# Altium schematic sheet TempSensor.SchDoc
size A; SheetNumber: 4; SheetTotal: 7
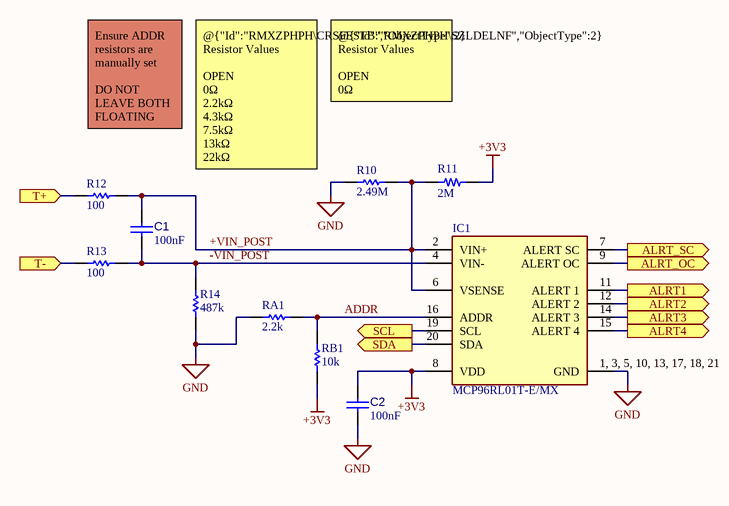
[diagram p0: TempSensor.SchDoc]

## Parts
C1  value 100nF  [CAP 0805_2012]  (hidden comment: CL21B104KBCNNNC)
C2  value 100nF  [CAP 0805_2012]  (hidden comment: CL21B104KBCNNNC)
IC1  MCP96RL01T-E/MX  [QFN65P500X500X100-21N-D]
R10  value 2.49M  [RES 0805_2012]  (hidden comment: CRCW08052M49FKEA)
R11  value 2M  [RES 0805_2012]  (hidden comment: CRCW08052M00FKECC)
R12  value 100  [RES 0805_2012]  (hidden comment: CRG0805F100R)
R13  value 100  [RES 0805_2012]  (hidden comment: CRG0805F100R)
R14  value 487k  [RES 0805_2012]  (hidden comment: ERJ-6ENF4873V)
RA1  value 2.2k  [RES 0805_2012]  (hidden comment: CRCW08052K20FKEAC)
RB1  value 10k  [RES 0805_2012]  (hidden comment: CRCW080510K0FKEAC)

## Ports
ALRT1 (out), ALRT2 (out), ALRT3 (out), ALRT4 (out), ALRT_OC (out), ALRT_SC (out), SCL (out), SDA (out), T+ (in), T- (in)

## Nets
+3V3: C2.1 IC1.8(VDD) R11.2 RB1.1
GND: C2.2 IC1.1,_3,_5,_10,_13,_17,_18,_21(GND) R10.1 R14.1 RA1.1
+VIN_POST: C1.2 IC1.2(VIN+) IC1.6(VSENSE) R10.2 R11.1 R12.2
-VIN_POST: C1.1 IC1.4(VIN-) R13.2 R14.2
ADDR: IC1.16(ADDR) RA1.2 RB1.2
ALRT1: IC1.11(ALERT_1) ; port ALRT1
ALRT2: IC1.12(ALERT_2) ; port ALRT2
ALRT3: IC1.14(ALERT_3) ; port ALRT3
ALRT4: IC1.15(ALERT_4) ; port ALRT4
ALRT_OC: IC1.9(ALERT_OC) ; port ALRT_OC
ALRT_SC: IC1.7(ALERT_SC) ; port ALRT_SC
SCL: IC1.19(SCL) ; port SCL
SDA: IC1.20(SDA) ; port SDA
T+: R12.1 ; port T+
T-: R13.1 ; port T-

## Notes on the sheet
- Ensure ADDR resistors are manually set
  DO NOT LEAVE BOTH FLOATING
- @{"Id":"RMXZPHPH\SZLDELNF","ObjectType":2} Resistor Values
  OPEN
  0Ω
  10kΩ
- (near R10) @{"Id":"RMXZPHPH\CRSFESTB","ObjectType":2} Resistor Values
  OPEN
  0Ω
  2.2kΩ
  4.3kΩ
  7.5kΩ
  13kΩ
  22kΩ
  43kΩ

## Library data of the parts
C1 C2 = CMP-001-00134-5: Ceramic Capacitor, Multilayer, Ceramic, 50V, 10% +Tol, 10% -Tol, X7R, 15% TC, 0.1uF, Surface Mount, 0805; Multilayer: Yes; Mounting Technology: Surface Mount; RoHS Compliant: Yes; Pins: 2; Capacitor Type: Ceramic; Min Operating Temperature: -55°C; Max Operating Temperature: 125°C; Case/Package: 0805; Dielectric Material: Ceramic; Height: 0.95mm; JESD-609 Code: e3; Length: 2mm; Package Shape: Rectangular; Package Style: SMTMeter; Packaging: Tape and Reel; Rated DC Voltage (URdc): 50V; Reach SVHC Compliant: Yes; Temperature Characteristics Code: X7R; Terminal Finish: Nickel; Termination: Wraparound; Tolerance  (fill in as +-): 10%; Tolerance (fill in as +-): 10%; Width: 1.25mm
IC1 = CMP-031-00000-3: Fully integrated thermocouple Electromotive Force (EMF) to degrees Celsius converter IC with integrated thermocouple open-circuit and short-circuit detection and cold-junction compensation; Manufacturer_Name: Microchip; altium.hash: 88D551B438FC0B2CC4B3D3B3F597121D; Manufacturer_Part_Number: MCP96RL01T-E/MX; Mouser Price/Stock: https://www.mouser.com/Search/Refine.aspx?Keyword=579-MCP96RL01T-E%2FMX; Design Item ID: MCP96RL01T-E_MX; Source: SamacSys.SchLib; Datasheet Link: http://ww1.microchip.com/downloads/en/DeviceDoc/MCP960X-L0X-RL0X-Data-Sheet-20005426F.pdf; Mouser Part Number: 579-MCP96RL01T-E/MX; Height: 1mm
R10 = CMP-009-00019-1: Fixed Resistor, Metal Glaze/thick Film, 0.125W, 2490000ohm, 150V, 1% +/-Tol, 100ppm/Cel, Surface Mount, 0805; Package Height: 0.45mm; Power: 125mW; Reference Standard: AEC-Q200; Package Length: 2mm; Package Width: 1.25mm; Rated Temperature: 70°C; Temperature Coefficient: 100ppm/°C; Termination: Wraparound; Working Voltage: 150V; Pins: 2; Min Operating Temperature: -55°C; RoHS Compliant: Yes; Terminal Finish: Nickel; Package Style: SMTMeter; Resistor Type: FIXED RESISTOR; Technology: METAL GLAZE/THICK FILM; Package Shape: Rectangular; Max Operating Temperature: 155°C; Reach SVHC Compliant: Yes; Case/Package: 0805; Tolerance: 1%; Packaging: Tape and Reel; Mounting Technology: Surface Mount; JESD-609 Code: e3; Construction: Chip
R11 = CMP-009-00017-3: Fixed Resistor, Metal Glaze/thick Film, 0.125W, 2000000ohm, 150V, 1% +/-Tol, 100ppm/Cel, Surface Mount, 0805; Manufacturer: Vishay Dale; Package Height: 0.5mm; Power (Watts): 0.125W, 1/8W; Package Length: 2mm; Power: 125mW; Package Width: 1.25mm; Temperature Coefficient: -100100ppm/°C; ComponentLink1Description: Datasheet; Series: CRCW-C; Package / Case: 0805 (2012 Metric); Case/Package: 0805; Number of Terminations: 2; Size / Dimension: 0.079" L x 0.049" W (2.00mm x 1.25mm); ComponentLink1URL: http://www.vishay.com/docs/28773/crcwce3.pdf; Lifecycle Status: Active; Device Package: 0805 (2012 Metric); Pins: 2; RoHS Compliant: Yes; Supplier Device Package: 0805; ComponentLink2Description: DigiKey Link; Resistor Type: FIXED RESISTOR; LastUpdated: 9/18/2022 12:42:15 PM; Construction: Chip; JESD-609 Code: e3; Technology: METAL GLAZE/THICK FILM; Working Voltage: 150V; Package Style: SMTMeter; Part Number: CRCW08052M00FKECC; Height - Seated (Max): 0.024" (0.60mm); Terminal Finish: Nickel; Packaging: Tape and Reel; Price: 0.01; Composition: Thick Film; PartId: 30004; Reach SVHC Compliant: Yes; Part Status: Active; Operating Temperature: -55°C ~ 155°C; Min Operating Temperature: -55°C; Max Operating Temperature: 155°C; Tolerance: 1%; ComponentLink2URL: https://www.digikey.com/en/products/detail/vishay-dale/CRCW08052M00FKECC/7928551; Minimum Order: 1; Component Type: Resistors; Design Item ID: CMP-309-001138-4; Manufacturer Part Number: CRCW08052M00FKECC; Source: HeatPress.SCHLIB
R12 R13 = CMP-009-00015-2: Fixed Resistor, Metal Glaze/thick Film, 0.125W, 100ohm, 150V, 1% +/-Tol, 200ppm/Cel, Surface Mount, 0805; Manufacturer Series: CRG; Manufacturer: TE Connectivity; Temperature Coefficient: 200ppm/°C; Additional Feature: LASER TRIMMABLE; MF: {'manufacturer': u'TE Connectivity'}; Rated Temperature: 70°C; Power: 125mW; Max Operating Temperature: 125°C; Design Item ID: CRG0805F100R; Working Voltage: 150V; Technology: METAL GLAZE/THICK FILM; Tolerance: 1%; Price: None; JESD-609 Code: e3; Mounting Technology: Surface Mount; MP: CRG0805F100R; Terminal Finish: Tin; RoHS Compliant: Yes; Case/Package: 0805; Availability: Unavailable; Pins: 2; Min Operating Temperature: -55°C; Source: CRG0805F100R.SchLib; Termination: Wraparound; Resistor Type: FIXED RESISTOR; Packaging: Tape and Reel; Package Shape: Rectangular; Component Type: Resistors; Manufacturer Part Number: CRG0805F100R
R14 = CMP-009-00021-1: Fixed Resistor, Metal Glaze/thick Film, 0.125W, 487000ohm, 150V, 1% +/-Tol, 100ppm/Cel, Surface Mount, 0805; Package Length: 2mm; Power: 125mW; Temperature Coefficient: 100ppm/°C; Package Height: 0.6mm; Reference Standard: AEC-Q200; Package Width: 1.25mm; Rated Temperature: 70°C; Min Operating Temperature: -55°C; Mounting Technology: Surface Mount; Package Shape: Rectangular; Technology: METAL GLAZE/THICK FILM; Case/Package: 0805; Package Style: SMTMeter; Termination: Wraparound; Reach SVHC Compliant: Yes; Pins: 2; Working Voltage: 150V; Max Operating Temperature: 155°C; Tolerance: 1%; RoHS Compliant: Yes; JESD-609 Code: e3; Packaging: Tape and Reel; Terminal Finish: Nickel; Construction: Rectangular; Resistor Type: FIXED RESISTOR
RA1 = CMP-009-00025-2: Fixed Resistor, Metal Glaze/thick Film, 0.125W, 2200ohm, 150V, 1% +/-Tol, 100ppm/Cel, Surface Mount, 0805; Package Width: 1.25mm; Package Length: 2mm; Power: 125mW; Package Height: 0.5mm; Rated Temperature: 70°C; Reference Standard: AEC-Q200; Temperature Coefficient: -100100ppm/°C; Reach SVHC Compliant: Yes; Max Operating Temperature: 155°C; Mounting Technology: Surface Mount; JESD-609 Code: e3; Package Style: SMTMeter; Pins: 2; Resistor Type: FIXED RESISTOR; Working Voltage: 150V; RoHS Compliant: Yes; Case/Package: 0805; Packaging: Tape and Reel; Terminal Finish: Nickel; Min Operating Temperature: -55°C; Technology: METAL GLAZE/THICK FILM; Construction: Chip; Termination: Wraparound; Tolerance: 1%; Package Shape: Rectangular
RB1 = CMP-009-00022-1: Fixed Resistor, Metal Glaze/thick Film, 0.125W, 10000ohm, 150V, 1% +/-Tol, 100ppm/Cel, Surface Mount, 0805; Package Width: 1.25mm; Temperature Coefficient: -100100ppm/°C; Power: 125mW; Package Height: 0.5mm; Package Length: 2mm; Min Operating Temperature: -55°C; Resistor Type: FIXED RESISTOR; Package Style: SMTMeter; Tolerance: 1%; RoHS Compliant: Yes; Construction: Chip; Reach SVHC Compliant: Yes; Pins: 2; Packaging: Tape and Reel; Max Operating Temperature: 155°C; Technology: METAL GLAZE/THICK FILM; Case/Package: 0805; JESD-609 Code: e3; Working Voltage: 150V; Terminal Finish: Nickel